# EasyEDA schematic SCH_generic_ecu_diagram.json
TITLE: AP4 Generic ECU Node Wiring; REV: 1.0; Date: 2023-08-31; Sheet: 1/1
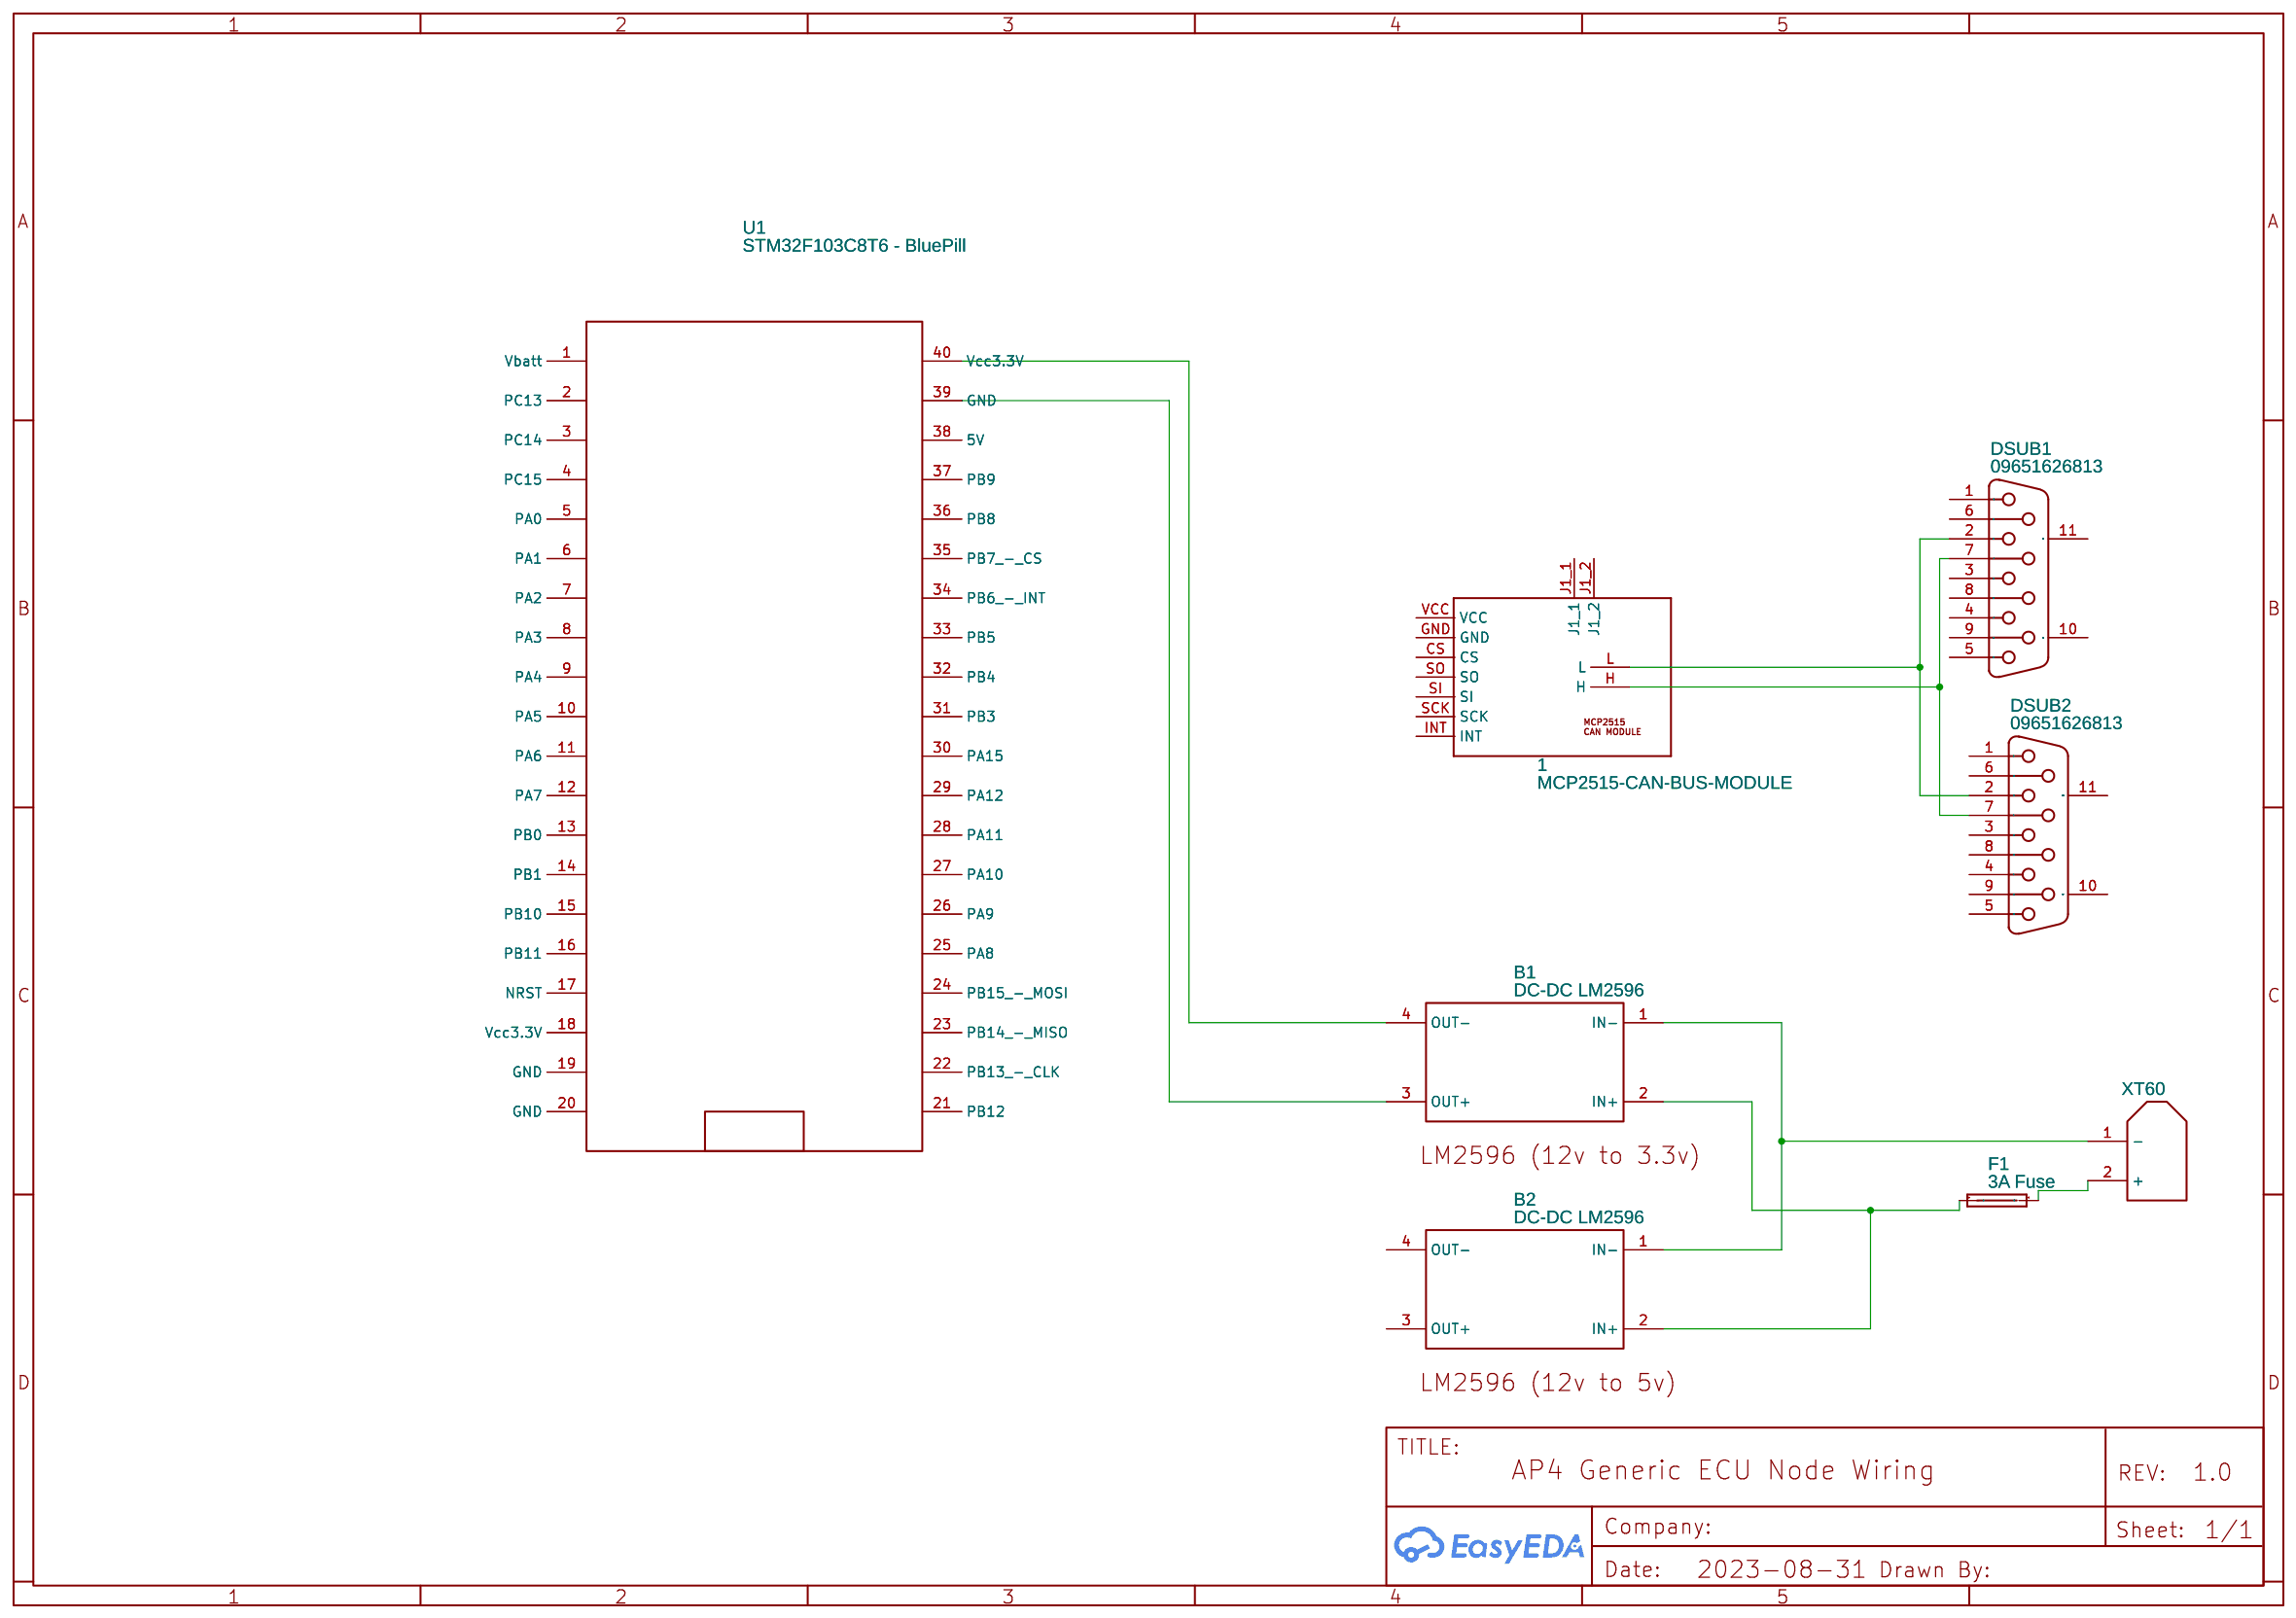
[diagram p0: schematic sheet]

## Parts
1  MCP2515-CAN-BUS-MODULE  [MCP2515-CAN-MODULE]
B1  DC-DC LM2596  [LM2596]
B2  DC-DC LM2596  [LM2596]
DSUB1  09651626813  [D-SUB-TH_0965162681]
DSUB2  09651626813  [D-SUB-TH_0965162681]
F1  3A Fuse  [FUSE-HOLDER-WITH-COVER-FOR-5X20MM-FUSE_FOOTPRINT]
NO  XT60  [XT60]
U1  STM32F103C8T6 - BluePill  [STM32F103C8T6-BLUEPILL]

## Library data of the parts
1 = MCP2515-CAN-BUS-MODULE: Contributor: Kaupoi
B1 B2 = DC-DC LM2596: Manufacturer Part: New SchematicLib; Contributor: pandualansumardisiagian
DSUB1 DSUB2 = 09651626813: Contributor: LCSC; Supplier: LCSC; Supplier Part: C698274; Manufacturer: Harting(浩亭); JLCPCB Part Class: Extended Part; link: https://lcsc.com/eda_search?q=C698274&%26type=1&ref=editor
F1 = FUSE HOLDER WITH COVER FOR 5X20MM FUSE: Contributor: rugved
NO = XT60: Manufacturer: AMASS; Supplier: AMASS; Contributor: dinul
U1 = BluePill: Manufacturer Part: STM32Duino; Contributor: Андрей Поливцев

## Nets
Net-(1-H): 1.H DSUB1.7 DSUB2.7
Net-(1-L): 1.L DSUB1.2 DSUB2.2
Net-(B1-1): B1.1(IN-) B2.1(IN-) NO.1(-)
Net-(B1-2): B1.2(IN+) B2.2(IN+) F1.1
Net-(F1-2): F1.2 NO.2(+)

Not connected (* = marked no-connect by the designer): 1 CS GND INT J1_1 J1_2 SCK SI SO VCC; B1 3(OUT+) 4(OUT-); B2 3(OUT+) 4(OUT-); DSUB1 1 3 4 5 6 8 9 10(MH1) 11(MH2); DSUB2 1 3 4 5 6 8 9 10(MH1) 11(MH2); U1 1(Vbatt) 2(PC13) 3(PC14) 4(PC15) 5(PA0) 6(PA1) 7(PA2) 8(PA3) 9(PA4) 10(PA5) 11(PA6) 12(PA7) 13(PB0) 14(PB1) 15(PB10) 16(PB11) 17(NRST) 18(Vcc3.3V) 19(GND) 20(GND) 21(PB12) 22(PB13 - CLK) 23(PB14 - MISO) 24(PB15 - MOSI) 25(PA8) 26(PA9) 27(PA10) 28(PA11) 29(PA12) 30(PA15) 31(PB3) 32(PB4) 33(PB5) 34(PB6 - INT) 35(PB7 - CS) 36(PB8) 37(PB9) 38(5V) 39(GND) 40(Vcc3.3V)
